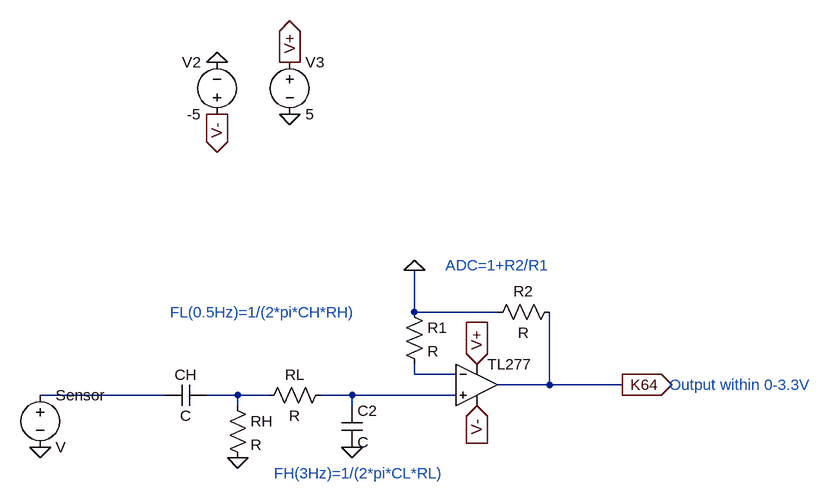
[diagram p0: schematic IDE_Lab8.asc]
IDE_Lab8.asc, the LTspice schematic file:
Version 4
SHEET 1 1104 680
WIRE 464 -32 464 -96
WIRE 592 -32 464 -32
WIRE 464 64 464 48
WIRE 528 64 464 64
WIRE 672 80 672 -32
WIRE 672 80 592 80
WIRE 784 80 672 80
WIRE 80 96 -112 96
WIRE 192 96 144 96
WIRE 240 96 192 96
WIRE 368 96 320 96
WIRE 528 96 368 96
WIRE 192 112 192 96
WIRE 368 112 368 96
FLAG -112 176 0
FLAG 192 192 0
FLAG 368 176 0
FLAG 160 -416 0
FLAG 272 -336 0
FLAG 784 80 K64
IOPIN 784 80 Out
FLAG 560 48 V+
IOPIN 560 48 In
FLAG 560 112 V-
IOPIN 560 112 In
FLAG 160 -336 V-
IOPIN 160 -336 Out
FLAG 272 -416 V+
IOPIN 272 -416 Out
FLAG 464 -96 0
SYMBOL voltage -112 80 R0
SYMATTR InstName Sensor
SYMBOL cap 144 80 R90
WINDOW 0 0 32 VBottom 2
WINDOW 3 32 32 VTop 2
SYMATTR InstName CH
SYMBOL res 176 96 R0
SYMATTR InstName RH
SYMBOL Opamps\\UniversalOpamp2 560 80 R0
SYMATTR InstName TL277
SYMBOL res 336 80 R90
WINDOW 0 0 56 VBottom 2
WINDOW 3 32 56 VTop 2
SYMATTR InstName RL
SYMBOL cap 352 112 R0
SYMATTR InstName C2
SYMBOL voltage 160 -320 R180
WINDOW 0 24 96 Left 2
WINDOW 3 24 16 Left 2
WINDOW 123 0 0 Left 0
WINDOW 39 0 0 Left 0
SYMATTR InstName V2
SYMATTR Value -5
SYMBOL voltage 272 -432 R0
WINDOW 123 0 0 Left 0
WINDOW 39 0 0 Left 0
SYMATTR InstName V3
SYMATTR Value 5
SYMBOL res 448 -48 R0
SYMATTR InstName R1
SYMBOL res 688 -48 R90
WINDOW 0 0 56 VBottom 2
WINDOW 3 32 56 VTop 2
SYMATTR InstName R2
TEXT 512 -104 Left 2 ;ADC=1+R2/R1
TEXT 88 -32 Left 2 ;FL(0.5Hz)=1/(2*pi*CH*RH)
TEXT 248 216 Left 2 ;FH(3Hz)=1/(2*pi*CL*RL)
TEXT 856 80 Left 2 ;Output within 0-3.3V

The netlist it stands for:
* IDE_Lab8.asc
V§Sensor N002 0 V
CH N003 N002 C
RH N003 0 R
XTL277 N004 N001 V+ V- K64 level.2 Avol=1Meg GBW=10Meg Slew=10Meg ilimit=25m rail=0 Vos=0 phimargin=45 en=0 enk=0 in=0 ink=0 Rin=500Meg  ; pins IN+ IN- V+ V- OUT
RL N004 N003 R
C2 N004 0 C
V2 V- 0 -5
V3 V+ 0 5
R1 0 N001 R
R2 K64 0 R
* ADC=1+R2/R1
* FL(0.5Hz)=1/(2*pi*CH*RH)
* FH(3Hz)=1/(2*pi*CL*RL)
* Output within 0-3.3V
.lib UniversalOpamps2.sub
.backanno
.end